# Altium schematic sheet USB_SERIAL_QUAD.SchDoc: AMC FMC Carrier v4
size 420 x 297 mm; CmpIndex: 15; Drawing Project: AMC FMC Carrier Board; SymIndex: 2141; CompanyName: WUT; Organization: WUT ISE; Address1: Warsaw Univeristy of Technology; Address2: Nowowiejska 15/19 00-665 Warsaw; Address3: t.przywozki@gmail.com; Revision: 1; SheetNumber: 28; SheetTotal: 29; Project: AMC FMC Carrier v4; ModifiedBy: -; CheckedDate: -; Title2: Quad USB - serial; DivGrp: ISE; Designer: T. Przywozki; ModifiedDate: -; ProjectName: ADC/DAC MEZZANINE
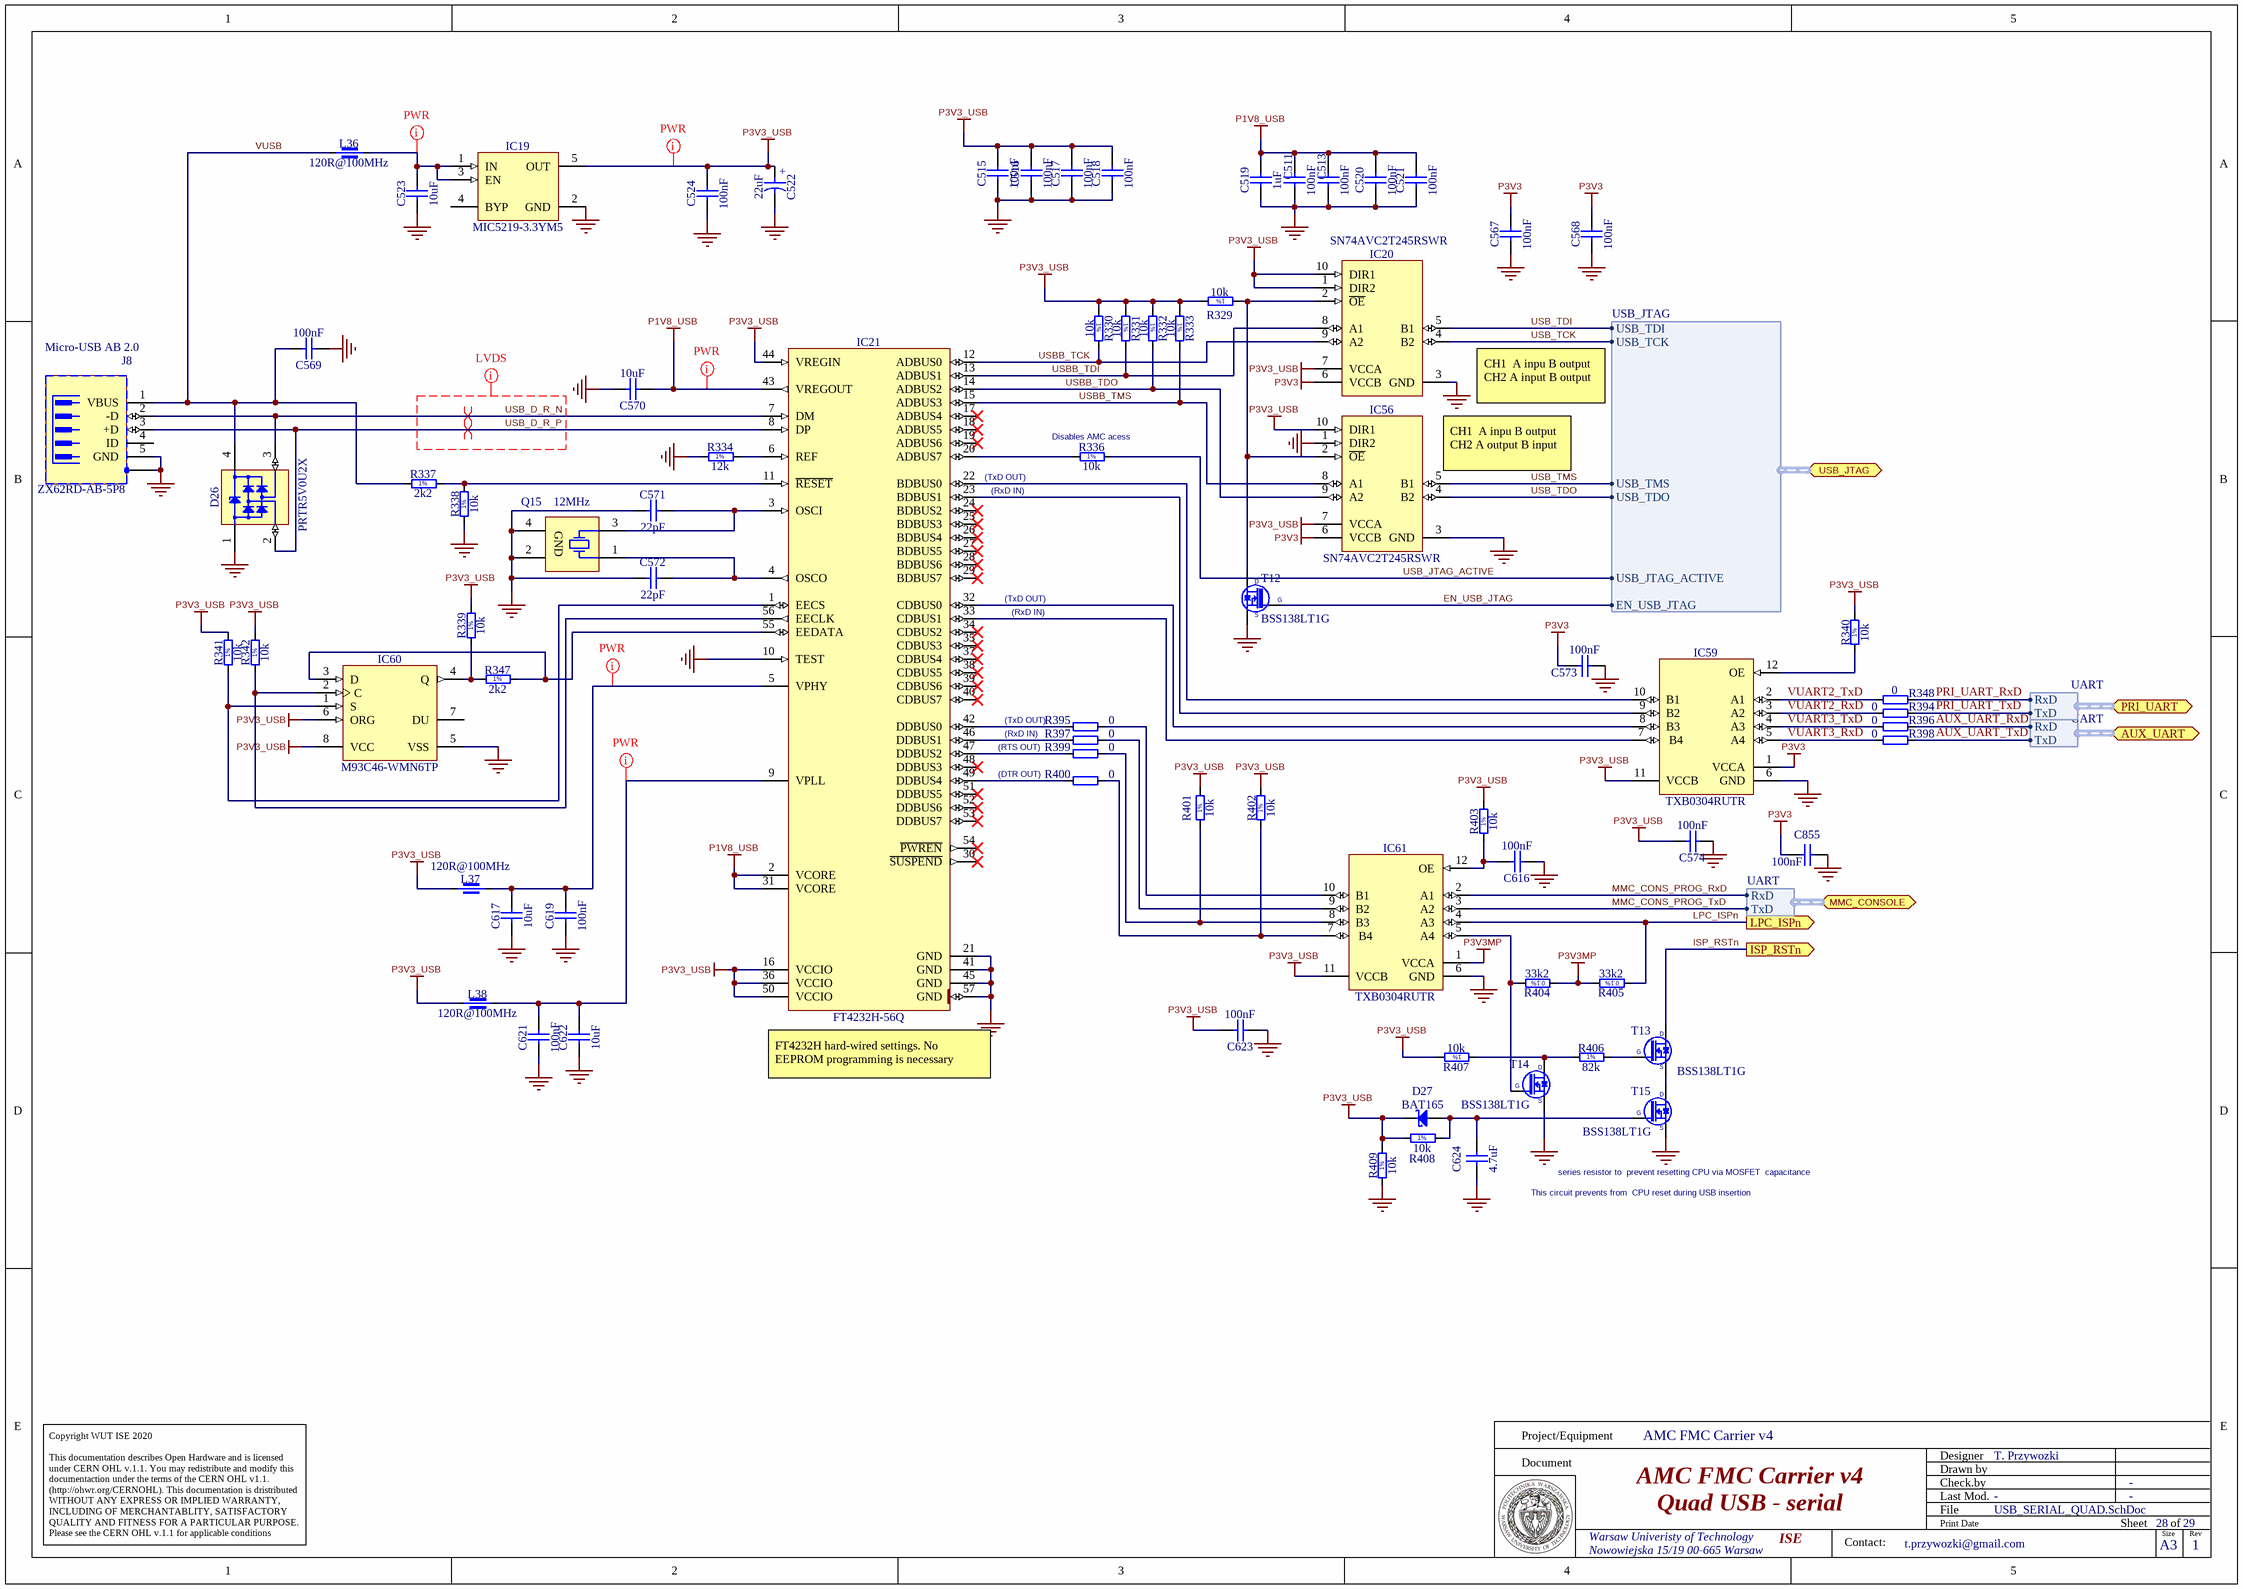
[diagram p0: USB_SERIAL_QUAD.SchDoc]

## Parts
C511  100nF  [CAPC0603X33N]
C513  100nF  [CAPC0603X33N]
C515  100nF  [CAPC0603X33N]
C516  100nF  [CAPC0603X33N]
C517  100nF  [CAPC0603X33N]
C518  100nF  [CAPC0603X33N]
C519  1uF  [CAPC1005X55N]
C520  100nF  [CAPC0603X33N]
C521  100nF  [CAPC0603X33N]
C522  22uF  [CAPMP3216X180N]
C523  10uF  [CAPC1608X87N]
C524  100nF  [CAPC0603X33N]
C567  100nF  [CAPC0603X33N]
C568  100nF  [CAPC0603X33N]
C569  100nF  [CAPC0603X33N]
C570  10uF  [CAPC1608X87N]
C571  22pF  [CAPC1005X55N]
C572  22pF  [CAPC1005X55N]
C573  100nF  [CAPC0603X33N]
C574  100nF  [CAPC0603X33N]
C616  100nF  [CAPC0603X33N]
C617  10uF  [CAPC1608X87N]
C619  100nF  [CAPC0603X33N]
C621  100nF  [CAPC0603X33N]
C622  10uF  [CAPC1608X87N]
C623  100nF  [CAPC0603X33N]
C624  4.7uF  [CAPC1709X95N]
C855  100nF  [CAPC0603X33N]
D26  PRTR5V0U2X  [SOT190P230X110-4N]
D27  BAT165  [SOD2512X110N]
IC19  MIC5219-3.3YM5  [SOT95P280X145-5N]
IC20  SN74AVC2T245RSWR  [QFN40P140X180X55-10N]
IC21  FT4232H-56Q  [QFN50P800X800X100-57N-S620]
IC56  SN74AVC2T245RSWR  [QFN40P140X180X55-10N]
IC59  TXB0304RUTR  [TEXAS_RUT (R-PUQFN-N12)]
IC60  M93C46-WMN6TP  [SOIC127P600X175-8N]
IC61  TXB0304RUTR  [TEXAS_RUT (R-PUQFN-N12)]
J8  Micro-USB AB 2.0  Manufacturer Part Number: ZX62RD-AB-5P8  [HIROSE_ZX62RD-AB-5P8]
L36  120R@100MHz  [INDC1608X65N]
L37  120R@100MHz  [INDC1608X65N]
L38  120R@100MHz  [INDC1608X65N]
Q15  12MHz  [XTAL_TXC_7M]
R329  10k  [RESC1005X40N]
R330  10k  [RESC1005X40N]
R331  10k  [RESC1005X40N]
R332  10k  [RESC1005X40N]
R333  10k  [RESC1005X40N]
R334  12k  [RESC1005X40N]
R336  10k  [RESC1005X40N]
R337  2k2  [RESC1005X40N]
R338  10k  [RESC1005X40N]
R339  10k  [RESC1005X40N]
R340  10k  [RESC1005X40N]
R341  10k  [RESC1005X40N]
R342  10k  [RESC1005X40N]
R347  2k2  [RESC1005X40N]
R348  0  [RESC1005X40N]
R394  0  [RESC1005X40N]
R395  0  [RESC1005X40N]
R396  0  [RESC1005X40N]
R397  0  [RESC1005X40N]
R398  0  [RESC1005X40N]
R399  0  [RESC1005X40N]
R400  0  [RESC1005X40N]
R401  10k  [RESC1005X40N]
R402  10k  [RESC1005X40N]
R403  10k  [RESC1005X40N]
R404  33k2  [RESC1608X55N]
R405  33k2  [RESC1608X55N]
R406  82k  [RESC1005X40N]
R407  10k  [RESC1005X40N]
R408  10k  [RESC1005X40N]
R409  10k  [RESC1005X40N]
T12  BSS138LT1G  [SOT95P240X110-3N]
T13  BSS138LT1G  [SOT95P240X110-3N]
T14  BSS138LT1G  [SOT95P240X110-3N]
T15  BSS138LT1G  [SOT95P240X110-3N]

## Ports
AUX_UART (bidir, harness UART), ISP_RSTn (out), LPC_ISPn (out), MMC_CONSOLE (bidir, harness UART), PRI_UART (bidir, harness UART), USB_JTAG (bidir, harness USB_JTAG)

## Harnesses
UART: RxD, TxD
USB_JTAG: USB_TDI, USB_TCK, USB_TMS, USB_TDO, USB_JTAG_ACTIVE, EN_USB_JTAG

## Nets
GND: C511.1 C513.1 C515.1 C516.1 C517.1 C518.1 C519.2 C520.1 C521.1 C522.2 C523.1 C524.1 C567.1 C568.1 C569.1 C570.2 C571.1 C572.1 C573.1 C574.1 C616.1 C617.1 C619.1 C621.1 C622.1 C623.1 C624.1 C855.1 D26.1(GND) IC19.2(GND) IC20.3(GND) IC21.10(TEST) IC21.21(GND) IC21.41(GND) IC21.45(GND) IC21.57(GND) IC56.1(DIR2) IC56.3(GND) IC59.6(GND) IC60.5(VSS) IC61.6(GND) J8.5(GND) J8.6(SH) Q15.2(GND) Q15.4(GND) R334.1 R338.1 R409.1 T12.2(S) T14.2(S) T15.2(S)
P1V8_USB: C511.2 C513.2 C519.1 C520.2 C521.2 C570.1 IC21.2(VCORE) IC21.31(VCORE) IC21.43(VREGOUT)
P3V3: C567.2 C568.2 C573.2 C855.2 IC20.6(VCCB) IC56.6(VCCB) IC59.1(VCCA)
P3V3_USB: C515.2 C516.2 C517.2 C518.2 C522.1 C524.2 C574.2 C623.2 D27.1(C) IC19.5(OUT) IC20.1(DIR2) IC20.7(VCCA) IC20.10(DIR1) IC21.16(VCCIO) IC21.36(VCCIO) IC21.44(VREGIN) IC21.50(VCCIO) IC56.7(VCCA) IC56.10(DIR1) IC59.11(VCCB) IC60.6(ORG) IC60.8(VCC) IC61.11(VCCB) L37.1 L38.1 R329.2 R330.1 R331.1 R332.1 R333.1 R339.2 R340.2 R341.2 R342.2 R401.2 R402.2 R403.2 R407.2 R408.1 R409.2
P3V3MP: IC61.1(VCCA) R404.1 R405.2
AUX_UART_RxD: R396.1 ; port AUX_UART.RxD
AUX_UART_TxD: R398.1 ; port AUX_UART.TxD
EN_USB_JTAG: T12.1(G) ; port USB_JTAG.EN_USB_JTAG
ISP_RSTn: T13.3(D) ; port ISP_RSTn
LPC_ISPn: IC61.4(A3) R405.1 ; port LPC_ISPn
MMC_CONS_PROG_RxD: IC61.2(A1) ; port MMC_CONSOLE.RxD
MMC_CONS_PROG_TxD: IC61.3(A2) ; port MMC_CONSOLE.TxD
PRI_UART_RxD: R348.1 ; port PRI_UART.RxD
PRI_UART_TxD: R394.1 ; port PRI_UART.TxD
USB_D_R_N: D26.3(I/O2) IC21.7(DM) J8.2(-D)
USB_D_R_P: D26.2(I/O1) IC21.8(DP) J8.3(+D)
USB_JTAG_ACTIVE: R336.2 ; port USB_JTAG.USB_JTAG_ACTIVE
USB_TCK: IC20.4(B2) ; port USB_JTAG.USB_TCK
USB_TDI: IC20.5(B1) ; port USB_JTAG.USB_TDI
USB_TDO: IC56.4(B2) ; port USB_JTAG.USB_TDO
USB_TMS: IC56.5(B1) ; port USB_JTAG.USB_TMS
USBB_TCK: IC20.9(A2) IC21.12(ADBUS0) R330.2
USBB_TDI: IC20.8(A1) IC21.13(ADBUS1) R331.2
USBB_TDO: IC21.14(ADBUS2) IC56.9(A2) R332.2
USBB_TMS: IC21.15(ADBUS3) IC56.8(A1) R333.2
VUART2_RxD: IC59.3(A2) R394.2
VUART2_TxD: IC59.2(A1) R348.2
VUART3_RxD: IC59.5(A4) R398.2
VUART3_TxD: IC59.4(A3) R396.2
VUSB: C569.2 D26.4(VCC) J8.1(VBUS) L36.1 R337.1
NetC523_2: C523.2 IC19.1(IN) IC19.3(EN) L36.2
NetC571_2: C571.2 IC21.3(OSCI) Q15.3(X)
NetC572_2: C572.2 IC21.4(OSCO) Q15.1(X)
NetC616_2: C616.2 IC61.12(OE) R403.1
NetC617_2: C617.2 C619.2 IC21.5(VPHY) L37.2
NetC621_2: C621.2 C622.2 IC21.9(VPLL) L38.2
NetC624_2: C624.2 D27.2(A) R408.2 T15.1(G)
NetIC20_2: IC20.2(~{OE}) IC56.2(~{OE}) R329.1 T12.3(D)
NetIC21_1: IC21.1(EECS) IC60.1(S) R341.1
NetIC21_6: IC21.6(REF) R334.2
NetIC21_11: IC21.11(~{RESET}) R337.2 R338.2
NetIC21_20: IC21.20(ADBUS7) R336.1
NetIC21_22: IC21.22(BDBUS0) IC59.10(B1)
NetIC21_23: IC21.23(BDBUS1) IC59.9(B2)
NetIC21_32: IC21.32(CDBUS0) IC59.8(B3)
NetIC21_33: IC21.33(CDBUS1) IC59.7(B4)
NetIC21_42: IC21.42(DDBUS0) R395.1
NetIC21_46: IC21.46(DDBUS1) R397.1
NetIC21_47: IC21.47(DDBUS2) R399.1
NetIC21_49: IC21.49(DDBUS4) R400.1
NetIC21_55: IC21.55(EEDATA) IC60.3(D) R347.2
NetIC21_56: IC21.56(EECLK) IC60.2(C) R342.1
NetIC59_12: IC59.12(OE) R340.1
NetIC60_4: IC60.4(Q) R339.1 R347.1
NetIC61_5: IC61.5(A4) R404.2 T14.1(G)
NetIC61_7: IC61.7(B4) R400.2 R402.1
NetIC61_8: IC61.8(B3) R399.2 R401.1
NetIC61_9: IC61.9(B2) R397.2
NetIC61_10: IC61.10(B1) R395.2
NetR406_1: R406.1 R407.1 T14.3(D)
NetR406_2: R406.2 T13.1(G)
NetT13_2: T13.2(S) T15.3(D)

Not connected (* = marked no-connect by the designer): IC19 4(BYP); IC21 17(ADBUS4)* 18(ADBUS5)* 19(ADBUS6)* 24(BDBUS2)* 25(BDBUS3)* 26(BDBUS4)* 27(BDBUS5)* 28(BDBUS6)* 29(BDBUS7)* 30(~{SUSPEND})* 34(CDBUS2)* 35(CDBUS3)* 37(CDBUS4)* 38(CDBUS5)* 39(CDBUS6)* 40(CDBUS7)* 48(DDBUS3)* 51(DDBUS5)* 52(DDBUS6)* 53(DDBUS7)* 54(~{PWREN})*; IC60 7(DU); J8 4(ID)

## Layout directives
net class PWR: NetC523_2, NetC617_2, NetC621_2, P1V8_USB, P3V3_USB
differential pair: USB_D_R_N, USB_D_R_P
net class LVDS: USB_D_R_N, USB_D_R_P

## Notes on the sheet
- CH1  A inpu B output
  CH2 A input B output
- (near R336) Disables AMC acess
- (near IC21) (TxD OUT)
- (RxD IN)
- (near IC56) CH1  A inpu B output
  CH2 A output B input
- (TxD OUT)
- (DTR OUT)
- (RTS OUT)
- (near IC21) FT4232H hard-wired settings. No EEPROM programming is necessary
- This circuit prevents from  CPU reset during USB insertion
- (near T15) series resistor to  prevent resetting CPU via MOSFET  capacitance
- Project/Equipment
- Document
- Designer
- Drawn by
- Check.by
- Copyright WUT ISE 2020
  This documentation describes Open Hardware and is licensed under CERN OHL v.1.1. You may redistribute and modify this documentaction under the terms of the CERN OHL v1.1.
  (http://ohwr.org/CERNOHL). This documentation is dristributed WITHOUT ANY EXPRESS OR IMPLIED WARRANTY, INCLUDING OF MERCHANTABLITY, SATISFACTORY QUALITY AND FITNESS FOR A PARTICULAR PURPOSE. Please see the CERN OHL v.1.1 for applicable conditions
- File
- Last Mod.
- Print Date
- Sheet
- Size
- A3
- of
- Rev
- Contact:
- (in symbol CTE3216-18_22UF_6.3V_10%_LESR0900) +
- (in symbol R0402_2K2_1%_0.0625W_100PPM) 1%
- (in symbol R0402_10K_1%_0.0625W_100PPM) 1%
- (in symbol R0402_12K_1%_0.0625W_100PPM) 1%
- (in symbol R0402_82K_1%_0.0625W_100PPM) 1%
- (in symbol R0603_33K2_0.1%_0.063W_10PPM) 0.1%

## Library data of the parts
C511 C513 C515-C518 C520 C521 C524 C567-C569 C573 C574 C616 C619 C621 C623 C855 = CC0201_100NF_6.3V_10%_X5R: Non-polarised capacitor; Manufacturer: GENERIC; Part Description: SMD Multilayer Chip Ceramic Capacitor; Manufacturer1 Part Number: 02016D104KAT2A; Tolerance: ±10%; Voltage: 6.3V; TC: X5R; Manufacturer Part Number: CC0201_100NF_6.3V_10%_X5R; Part Number: CC0201_100NF_6.3V_10%_X5R; Value: 100nF; Component Kind: Standard; Component Type: Standard; Pin Count: 2; Status: Not Recommended; Case: 0201; Mounted: Yes; Socket: No; SMD: Yes; Sense: No; Manufacturer1 Example: AVX; Manufacturer1 ComponentHeight: 0.33mm; HelpURL: \\cern.ch\dfs\Applications\Altium\Datasheets\CC0201_X5R_AVX.pdf; Author: CERN DEM JLC; CreateDate: 03.12.2007; LatestRevisionDate: 03.12.2007
C519 = CC0402_1UF_16V_10%_X5R: Non-polarised capacitor; Manufacturer: GENERIC; Part Description: SMD Multilayer Chip Ceramic Capacitor; Manufacturer1 Part Number: C1005X5R1C105KT; Tolerance: ±10%; Voltage: 16V; TC: X5R; Manufacturer Part Number: CC0402_1UF_16V_10%_X5R; Part Number: CC0402_1UF_16V_10%_X5R; Value: 1uF; Component Kind: Standard; Component Type: Standard; Pin Count: 2; Status: Preferred; Case: 0402; Mounted: Yes; Socket: No; SMD: Yes; Sense: No; Manufacturer1 Example: TDK; Manufacturer1 ComponentHeight: 0.55mm; HelpURL: \\cern.ch\dfs\Applications\Altium\Datasheets\CC0402_X5R_TDK_C.pdf; Author: CERN DEM JLC; CreateDate: 25.10.2012; LatestRevisionDate: 25.10.2012
C522 = CTE3216-18_22UF_6.3V_10%_LESR0900: Polarised capacitor; Manufacturer: GENERIC; Part Description: Low ESR 0R9 Solid Tantalum Chip Capacitor; Manufacturer1 Part Number: TPSA226K006R0900; Tolerance: ±10%; Voltage: 6.3V; Manufacturer Part Number: CTE3216-18_22UF_6.3V_10%_LESR0900; Part Number: CTE3216-18_22UF_6.3V_10%_LESR0900; Value: 22uF; Component Kind: Standard; Component Type: Standard; Pin Count: 2; Status: Preferred; Case: A; Mounted: Yes; Socket: No; SMD: Yes; Sense: No; Manufacturer1 Example: AVX; Manufacturer1 ComponentHeight: 1.8mm; HelpURL: \\cern.ch\dfs\Applications\Altium\Datasheets\CTE-LESR_AVX_TPS.pdf; Author: CERN DEM JLC; CreateDate: 05.05.2008; LatestRevisionDate: 20.01.2009
C523 C570 C617 C622 = CC0603_10UF_6.3V_20%_X5R: Non-polarised capacitor; Manufacturer: GENERIC; Part Description: SMD Multilayer Chip Ceramic Capacitor; Manufacturer1 Part Number: C0603C106M9PAC; Tolerance: ±20%; Voltage: 6.3V; TC: X5R; Manufacturer Part Number: CC0603_10uF_6.3V_20%_X5R; Part Number: CC0603_10UF_6.3V_20%_X5R; Value: 10uF; Component Kind: Standard; Component Type: Standard; Pin Count: 2; Status: Preferred; Case: 0603; Mounted: Yes; Socket: No; SMD: Yes; Sense: No; Manufacturer1 Example: KEMET; Manufacturer1 ComponentHeight: 0.95mm; HelpURL: \\cern.ch\dfs\Applications\Altium\Datasheets\CC0603_X5R_KEMET.pdf; Author: CERN DEM JLC; CreateDate: 03.12.2007; LatestRevisionDate: 03.12.2007
C571 C572 = CC0402_22PF_50V_5%_C0G: Non-polarised capacitor; Manufacturer: GENERIC; Part Description: SMD Multilayer Chip Ceramic Capacitor; Manufacturer1 Part Number: C0402C220J5GACTU; Tolerance: ±5%; Voltage: 50V; TC: C0G/NP0; Manufacturer Part Number: CC0402_22PF_50V_5%_C0G; Part Number: CC0402_22PF_50V_5%_C0G; Value: 22pF; Component Kind: Standard; Component Type: Standard; Pin Count: 2; Status: Preferred; Case: 0402; Mounted: Yes; Socket: No; SMD: Yes; Sense: No; Manufacturer1 Example: KEMET; Manufacturer1 ComponentHeight: 0.55mm; HelpURL: \\cern.ch\dfs\Applications\Altium\Datasheets\CC0805_C0G_KEMET_(Commercial Grade).pdf; Author: CERN DEM JLC; CreateDate: 03.12.2007; LatestRevisionDate: 03.12.2007
C624 = CC0603_4.7UF_16V_10%_X5R: Non-polarised capacitor; Manufacturer: GENERIC; Part Description: SMD Multilayer Chip Ceramic Capacitor; Manufacturer1 Part Number: EMK107ABJ475KA-T; Tolerance: ±10%; Voltage: 16V; TC: X5R; Manufacturer Part Number: CC0603_4.7UF_16V_10%_X5R; Part Number: CC0603_4.7UF_16V_10%_X5R; Value: 4.7uF; Component Kind: Standard; Component Type: Standard; Pin Count: 2; Status: None; Case: 0603; Mounted: Yes; Socket: No; SMD: Yes; Sense: No; Manufacturer1 Example: TAIYO YUDEN; Manufacturer1 ComponentHeight: 0.95mm; HelpURL: \\cern.ch\dfs\Applications\Altium\Datasheets\CC0603_X7R_TAIYO-YUDEN_HIGH-VALUE.pdf; Author: CERN DEM JLC; CreateDate: 16.12.2013; LatestRevisionDate: 16.09.2014
D26 = PRTR5V0U2X: Ultra Low Capacitance Double Rail-to-Rail ESD Protection Diode; Manufacturer: NXP SEMICONDUCTORS; Part Description: Ultra Low Capacitance (1pF) Double Rail-to-Rail ESD Protection Diode (8kV); Voltage: 5.5V; PressFit: No; Bonding: No; Manufacturer Part Number: PRTR5V0U2X; PackageDescription: SOT143B, SOT, 1.90mm Pitch; 4 Pin, 1.30mm W X 2.90mm L X 1.10mm H body, IPC Medium Density; Part Number: PRTR5V0U2X; Component Kind: Standard; Component Type: Standard; Device: PRTR5V0U2X; Pin Count: 4; Case: SOT143B; Mounted: Yes; Socket: No; SMD: Yes; Sense: No; ComponentHeight: 1.1mm; HelpURL: \\cern.ch\dfs\Applications\Altium\Datasheets\PRTR5V0U2X.pdf; Author: CERN DEM JLC; CreateDate: 22.03.2011; LatestRevisionDate: 22.03.2011
D27 = BAT165: Schottky Diode; Manufacturer: INFINEON; Part Description: Medium Power AF Schottky Diode; Voltage: 40V; Power: 750mA; PressFit: No; Bonding: No; Manufacturer Part Number: BAT165; PackageDescription: Small Outline Diode (SOD-323), 1.70mm W X 1.25mm L X 1.10mm H body,  IPC Medium Density; Part Number: BAT165; Component Kind: Standard; Component Type: Standard; Device: BAT165; Pin Count: 2; Case: SOD323; Mounted: Yes; Socket: No; SMD: Yes; Sense: No; ComponentHeight: 1.1mm; HelpURL: \\cern.ch\dfs\Applications\Altium\Datasheets\BAT165.pdf; Author: CERN DEM JLC; CreateDate: 12.11.2014; LatestRevisionDate: 12.11.2014
IC19 = MIC5219-3.3YM5: 500mA Peak Output LDO Regulator; Part Description: 3.3V 500mA Peak Output Low Drop-Out  (LDO) Regulator; Manufacturer: MICROCHIP TECHNOLOGY; PressFit: No; Bonding: No; Part Number: MIC5219-3.3YM5; Component Kind: Standard; Component Type: Standard; Device: MIC5219-3.3YM5; PackageDescription: SOT, 0.95mm pitch; 5 pin, 1.60mm W X 2.90mm L X 1.45mm H body, IPC Medium Density; Manufacturer Part Number: MIC5219-3.3YM5; Pin Count: 5; Case: SOT23-5; Mounted: Yes; Socket: No; SMD: Yes; Sense: No; ComponentHeight: 1.45mm; HelpURL: \\cern.ch\dfs\Applications\Altium\Datasheets\MIC5219-3.3YM5.pdf; Author: CERN DEM WB; CreateDate: 16.04.2019; LatestRevisionDate: 16.04.2019
IC20 IC56 = SN74AVC2T245RSWR: Dual-Bit Dual-Supply Bus Transceiver With Configurable Voltage Translation and 3-State Outputs; Manufacturer: TEXAS INSTRUMENTS; PressFit: No; Bonding: No; Manufacturer Part Number: SN74AVC2T245RSWR; PackageDescription: QFN, 0.40mm Pitch, Rect.;10 Pin, 1.80mm L X 1.40mm W X 0.55mm H Body, IPC Medium Density; Part Description: Dual-Bit Dual-Supply Bus Transceiver With Configurable Voltage Translation and 3-State Outputs; Part Number: SN74AVC2T245RSWR; Component Kind: Standard; Component Type: Standard; Device: SN74AVC2T245RSWR; Status: Not Recommended; Pin Count: 10; Case: QFN10; Mounted: Yes; Socket: No; SMD: Yes; Sense: No; ComponentHeight: 0.55mm; Author: CERN DEM JLC; HelpURL: \\cern.ch\dfs\Applications\Altium\Datasheets\SN74AVC2T245RSWR.pdf; CreateDate: 07.07.2014; LatestRevisionDate: 30.03.2017
IC21 = FT4232H-56Q: Quad High Speed USB to Multipurpose UART/MPSSE IC; Manufacturer: FUTURE TECHNOLOGY DEVICES INTERNATIONAL (FTDI); PressFit: No; Bonding: No; Manufacturer Part Number: FT4232H-56Q; PackageDescription: QFN, 0.50mm Pitch, Square; 56 Pin, 8.00mm L X 8.00mm W X 1.00mm H body (6.1mm X 6.1mm Thermal tab), IPC Medium Density; Part Description: Quad High Speed USB to Multipurpose UART/MPSSE IC; Part Number: FT4232H-56Q; Component Kind: Standard; Component Type: Standard; Device: FT4232H-56Q; Pin Count: 57; Case: QFN56; Mounted: Yes; Socket: No; SMD: Yes; Sense: No; ComponentHeight: 1mm; Author: CERN DEM JLC; HelpURL: \\cern.ch\dfs\Applications\Altium\Datasheets\FT4232H-56Q.pdf; CreateDate: 11.10.2016; LatestRevisionDate: 11.10.2016
IC59 IC61 = TXB0304RUTR: 4-bit Bidirectional Auto-direction Sensing Translator with Fully Symmetric 0.9V to 3.6V Range; Manufacturer: TEXAS INSTRUMENTS; PressFit: No; Bonding: No; Manufacturer Part Number: TXB0304RUTR; PackageDescription: SON, TEXAS RUT (R-PUQFN-N12), 0.50mm Pitch, 12-pin, 1.70mm W  X 2.00mm L X 0.55mm Height; Part Description: 4-bit Bidirectional Auto-direction Sensing Translator with Fully Symmetric 0.9V to 3.6V Range; Part Number: TXB0304RUTR; Component Kind: Standard; Component Type: Standard; Device: TXB0304RUTR; Pin Count: 12; Case: QFN12; Mounted: Yes; Socket: No; SMD: Yes; Sense: No; ComponentHeight: 0.55mm; Author: CERN DEM JLC; HelpURL: \\cern.ch\dfs\Applications\Altium\Datasheets\TXB0304RUTR.pdf; CreateDate: 27.10.2014; LatestRevisionDate: 28.10.2014
IC60 = M93C46-WMN6TP: 2.5 to 5.5 V, 1Kb (128x8) Serial Microwire Bus EEPROM; Manufacturer: ST MICROELECTRONICS; Part Description: 1Kbit (128 x 8 bit or 64 x 16 bit) MICROWIRE® Serial Access EEPROM; PressFit: No; Bonding: No; Manufacturer Part Number: M93C46-WMN6TP; PackageDescription: SOIC 8, Pitch 1.27mm - Body 4x5mm, IPC Medium Density; Part Number: M93C46-WMN6TP; Component Kind: Standard; Component Type: Standard; Device: M93C46-WMN6TP; Pin Count: 8; Case: SOIC8; Mounted: Yes; Socket: No; SMD: Yes; Sense: No; ComponentHeight: 1.75mm; HelpURL: \\cern.ch\dfs\Applications\Altium\Datasheets\M93C46-WMN6TP.pdf; Author: CERN DEM JLC; CreateDate: 15.11.2012; LatestRevisionDate: 15.11.2012
J8 = HIROSE_ZX62RD-AB-5P8: 5 Pin + 1 Shield USB Receptacle; Manufacturer: HIROSE (HRS); Part Description: Micro-USB 2.0 Right Angle, SMD Type AB - Reverse (Top mount), Shell Through Hole; PressFit: No; Part Number: HIROSE_ZX62RD-AB-5P8; Component Kind: Standard; Component Type: Standard; Pin Count: 7; Family: Micro-USB AB 2.0; Mounted: Yes; Socket: No; SMD: Yes; Sense: No; Status: Obsolete; ComponentHeight: 2.35mm; HelpURL: \\cern.ch\dfs\Applications\Altium\Datasheets\HIROSE_ZX62RD-AB-5P8.pdf; ComponentLink1URL: \\cern.ch\dfs\Applications\Altium\Datasheets\HIROSE_ZX62RD-AB-5P8_Package-Drawing.pdf; ComponentLink1Description: Package-Drawing; Author: CERN DEM JLC; CreateDate: 29.10.2014; LatestRevisionDate: 22.06.2017
L36-L38 = IND0603_MURATA_BLM18SG121TN1D: Manufacturer: MURATA; Part Description: SMD EMIFIL Suppression Chip Ferrite Bead; Tolerance: ±25%; Power: 3A; Resistance: 0.025R; Manufacturer Part Number: BLM18SG121TN1D; Part Number: IND0603_MURATA_BLM18SG121TN1D; Value: 120R@100MHz; Component Kind: Standard; Component Type: Standard; Pin Count: 2; Status: None; Case: 0603; Mounted: Yes; Socket: No; SMD: Yes; Sense: No; ComponentHeight: 0.65mm; HelpURL: \\cern.ch\dfs\Applications\Altium\Datasheets\IND0603_MURATA_BLM18S.pdf; Author: CERN DEM JLC; CreateDate: 23.07.2014; LatestRevisionDate: 25.10.2018
Q15 = XTAL_12MHZ_TXC_7M-12.000MAAJ-T: Crystal 4 pins 1=XTAL Control 2=GND3=XTAL 4=GND; Manufacturer: TXC CORPORATION; Part Description: ±30ppm 18pF -20°C to +70°C  4 Pins, 3.2x2.5X0.8mm, SMD Sealing Crystal, 7M Series; PressFit: No; Bonding: No; Manufacturer Part Number: 7M-12.000MAAJ-T; PackageDescription: 4 Pins, 2.5x3.2mm, SMD Sealing Crystal, 7M Serie; Part Number: XTAL_12MHZ_TXC_7M-12.000MAAJ-T; Value: 12MHz; Component Kind: Standard; Component Type: Standard; Pin Count: 4; Mounted: Yes; Socket: No; SMD: Yes; Sense: No; ComponentHeight: 0.8mm; HelpURL: \\cern.ch\dfs\Applications\Altium\Datasheets\XTAL_TXC_7M.pdf; Author: CERN DEM JLC; CreateDate: 19.06.2012; LatestRevisionDate: 19.06.2012
R329-R333 R336 R338-R342 R401-R403 R407-R409 = R0402_10K_1%_0.0625W_100PPM: Resistor - 1%; Manufacturer: GENERIC; Part Description: General Purpose Thick Film Chip Resistor; Manufacturer1 Part Number: 232270671003L; TC: ±100ppm/°C; PressFit: No; Manufacturer Part Number: R0402_10K_1%_0.0625W_100PPM; Part Number: R0402_10K_1%_0.0625W_100PPM; Tolerance: ±1%; Value: 10k; Component Kind: Standard; Component Type: Standard; Pin Count: 2; Status: Not Recommended; Power: 0.0625W; Case: 0402; Mounted: Yes; Sense: No; Socket: No; SMD: Yes; Manufacturer1 Example: YAGEO PHYCOMP; Manufacturer1 ComponentHeight: 0.4mm; HelpURL: \\cern.ch\dfs\Applications\Altium\Datasheets\R0402_Phycomp_RC0402.pdf; Author: CERN DEM JLC; CreateDate: 03.12.2007; LatestRevisionDate: 17.10.2012
R334 = R0402_12K_1%_0.0625W_100PPM: Resistor - 1%; Manufacturer: GENERIC; Part Description: General Purpose Thick Film Chip Resistor; Manufacturer1 Part Number: 232270671203L; TC: ±100ppm/°C; PressFit: No; Manufacturer Part Number: R0402_12K_1%_0.0625W_100PPM; Part Number: R0402_12K_1%_0.0625W_100PPM; Tolerance: ±1%; Value: 12k; Component Kind: Standard; Component Type: Standard; Pin Count: 2; Status: Not Recommended; Power: 0.0625W; Case: 0402; Mounted: Yes; Sense: No; Socket: No; SMD: Yes; Manufacturer1 Example: YAGEO PHYCOMP; Manufacturer1 ComponentHeight: 0.4mm; HelpURL: \\cern.ch\dfs\Applications\Altium\Datasheets\R0402_Phycomp_RC0402.pdf; Author: CERN DEM JLC; CreateDate: 03.12.2007; LatestRevisionDate: 17.10.2012
R337 R347 = R0402_2K2_1%_0.0625W_100PPM: Resistor - 1%; Manufacturer: GENERIC; Part Description: General Purpose Thick Film Chip Resistor; Manufacturer1 Part Number: 232270672202L; TC: ±100ppm/°C; PressFit: No; Manufacturer Part Number: R0402_2K2_1%_0.0625W_100PPM; Part Number: R0402_2K2_1%_0.0625W_100PPM; Tolerance: ±1%; Value: 2k2; Component Kind: Standard; Component Type: Standard; Pin Count: 2; Status: Not Recommended; Power: 0.0625W; Case: 0402; Mounted: Yes; Sense: No; Socket: No; SMD: Yes; Manufacturer1 Example: YAGEO PHYCOMP; Manufacturer1 ComponentHeight: 0.4mm; HelpURL: \\cern.ch\dfs\Applications\Altium\Datasheets\R0402_Phycomp_RC0402.pdf; Author: CERN DEM JLC; CreateDate: 03.12.2007; LatestRevisionDate: 17.10.2012
R348 R394-R400 = R0402_0R_JUMPER: Resistor; Manufacturer: GENERIC; Part Description: 1A (0.05R Max DC Resistance) Zero Ohm Jumper; Manufacturer1 Part Number: 232270591001L; PressFit: No; Manufacturer Part Number: R0402_0R_JUMPER; Part Number: R0402_0R_JUMPER; Value: 0; Component Kind: Standard; Component Type: Standard; Pin Count: 2; Status: Not Recommended; Case: 0402; Mounted: Yes; Sense: No; Socket: No; SMD: Yes; Manufacturer1 Example: YAGEO PHYCOMP; Manufacturer1 ComponentHeight: 0.4mm; HelpURL: \\cern.ch\dfs\Applications\Altium\Datasheets\R0402_Phycomp_RC0402.pdf; Author: CERN DEM JLC; CreateDate: 03.12.2007; LatestRevisionDate: 17.10.2012
R404 R405 = R0603_33K2_0.1%_0.063W_10PPM: Resistor - 0.1%; Manufacturer: GENERIC; Part Description: Thin Film Chip Resistor; Manufacturer1 Part Number: RN73C1J33K2BTDF; Power: 0.063W; TC: ±10ppm; PressFit: No; Manufacturer Part Number: R0603_33K2_0.1%_0.063W_10PPM; Part Number: R0603_33K2_0.1%_0.063W_10PPM; Tolerance: ±0.1%; Value: 33k2; Component Kind: Standard; Component Type: Standard; Pin Count: 2; Status: Not Recommended; Case: 0603; Mounted: Yes; Sense: No; Socket: No; SMD: Yes; Manufacturer1 Example: TYCO HOLSWORTHY; Manufacturer1 ComponentHeight: 0.5mm; HelpURL: \\cern.ch\dfs\Applications\Altium\Datasheets\R0603_Tyco_RN73.pdf; Author: CERN DEM JLC; CreateDate: 03.12.2007; LatestRevisionDate: 13.03.2008
R406 = R0402_82K_1%_0.0625W_100PPM: Resistor - 1%; Manufacturer: GENERIC; Part Description: General Purpose Thick Film Chip Resistor; Manufacturer1 Part Number: 232270678203L; TC: ±100ppm/°C; PressFit: No; Manufacturer Part Number: R0402_82K_1%_0.0625W_100PPM; Part Number: R0402_82K_1%_0.0625W_100PPM; Tolerance: ±1%; Value: 82k; Component Kind: Standard; Component Type: Standard; Pin Count: 2; Status: Not Recommended; Power: 0.0625W; Case: 0402; Mounted: Yes; Sense: No; Socket: No; SMD: Yes; Manufacturer1 Example: YAGEO PHYCOMP; Manufacturer1 ComponentHeight: 0.4mm; HelpURL: \\cern.ch\dfs\Applications\Altium\Datasheets\R0402_Phycomp_RC0402.pdf; Author: CERN DEM JLC; CreateDate: 03.12.2007; LatestRevisionDate: 17.10.2012
T12-T15 = BSS138LT1G: N-CHANNEL MOSFET WITH DIODE; Manufacturer: ON SEMICONDUCTOR; Part Description: 50V 200mA N-Channel Enhancement Mode Field-Effect Transistor; PressFit: No; Bonding: No; Manufacturer Part Number: BSS138LT1G; PackageDescription: SOT23 3-Leads, Pitch 0.95mm - Body 1.4x3mm, IPC Medium Density; Part Number: BSS138LT1G; Component Kind: Standard; Component Type: Standard; Device: BSS138LT1G; Pin Count: 3; Case: SOT23-3; Mounted: Yes; Socket: No; SMD: Yes; Sense: No; ComponentHeight: 1.11mm; HelpURL: \\cern.ch\dfs\Applications\Altium\Datasheets\BSS138LT1G.pdf; Author: CERN DEM JLC; CreateDate: 23.03.2009; LatestRevisionDate: 23.03.2009